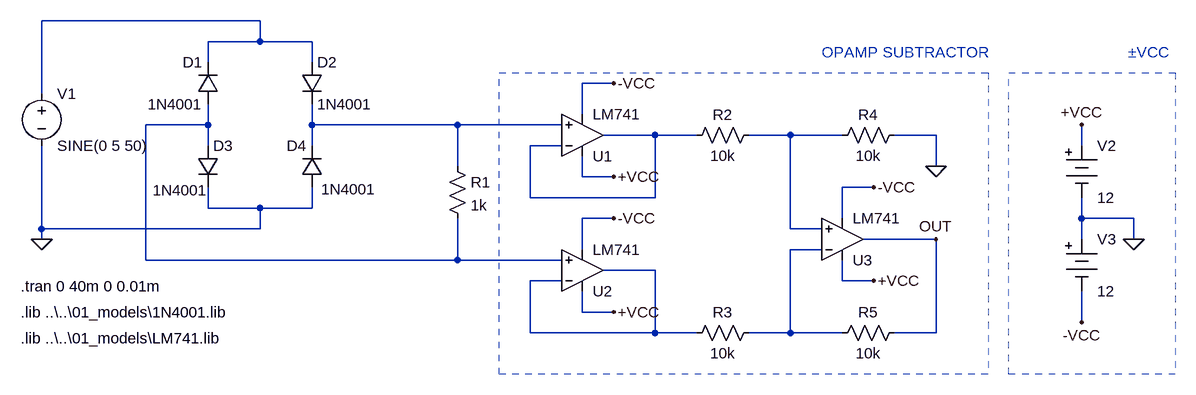
[diagram p0: schematic acdcconv_01_04_01_00_bridge_vr.asc]
acdcconv_01_04_01_00_bridge_vr.asc, the LTspice schematic file:
Version 4
SHEET 1 1572 680
WIRE 160 32 -176 32
WIRE 160 64 160 32
WIRE 160 64 80 64
WIRE 240 64 160 64
WIRE 80 96 80 64
WIRE 240 96 240 64
WIRE 704 128 656 128
WIRE -176 144 -176 32
WIRE 656 176 656 128
WIRE 80 192 80 160
WIRE 80 192 -16 192
WIRE 240 192 240 160
WIRE 464 192 240 192
WIRE 624 192 464 192
WIRE 768 208 688 208
WIRE 832 208 768 208
WIRE 976 208 912 208
WIRE 1056 208 976 208
WIRE 1200 208 1136 208
WIRE 80 224 80 192
WIRE 240 224 240 192
WIRE 624 224 576 224
WIRE 1424 224 1424 192
WIRE 464 256 464 192
WIRE 1200 256 1200 208
WIRE 656 272 656 240
WIRE 704 272 656 272
WIRE 1104 288 1056 288
WIRE 576 304 576 224
WIRE 768 304 768 208
WIRE 768 304 576 304
WIRE 80 320 80 288
WIRE 160 320 80 320
WIRE 240 320 240 288
WIRE 240 320 160 320
WIRE 704 336 656 336
WIRE 1056 336 1056 288
WIRE 1424 336 1424 304
WIRE 1504 336 1424 336
WIRE -176 352 -176 224
WIRE 160 352 160 320
WIRE 160 352 -176 352
WIRE 976 352 976 208
WIRE 1024 352 976 352
WIRE -176 368 -176 352
WIRE 1200 368 1088 368
WIRE 1424 368 1424 336
WIRE 1504 368 1504 336
WIRE 656 384 656 336
WIRE 1024 384 976 384
WIRE -16 400 -16 192
WIRE 464 400 464 336
WIRE 464 400 -16 400
WIRE 624 400 464 400
WIRE 768 416 688 416
WIRE 624 432 576 432
WIRE 1056 432 1056 400
WIRE 1104 432 1056 432
WIRE 656 480 656 448
WIRE 704 480 656 480
WIRE 1424 496 1424 448
WIRE 576 512 576 432
WIRE 768 512 768 416
WIRE 768 512 576 512
WIRE 832 512 768 512
WIRE 976 512 976 384
WIRE 976 512 912 512
WIRE 1056 512 976 512
WIRE 1200 512 1200 368
WIRE 1200 512 1136 512
FLAG -176 368 0
FLAG 1200 256 0
FLAG 1504 368 0
FLAG 1424 192 +VCC
FLAG 1424 496 -VCC
FLAG 704 272 +VCC
FLAG 704 128 -VCC
FLAG 704 480 +VCC
FLAG 704 336 -VCC
FLAG 1104 432 +VCC
FLAG 1104 288 -VCC
FLAG 1200 368 OUT
SYMBOL diode 96 160 R180
WINDOW 0 24 64 Left 2
WINDOW 3 24 0 Left 2
SYMATTR InstName D1
SYMATTR Value 1N4001
SYMBOL diode 224 96 R0
SYMATTR InstName D2
SYMATTR Value 1N4001
SYMBOL diode 64 224 R0
WINDOW 3 -69 69 Left 2
SYMATTR Value 1N4001
SYMATTR InstName D3
SYMBOL diode 256 288 R180
WINDOW 0 24 64 Left 2
WINDOW 3 2 -3 Right 2
SYMATTR InstName D4
SYMATTR Value 1N4001
SYMBOL res 448 240 R0
SYMATTR InstName R1
SYMATTR Value 1k
SYMBOL voltage -176 128 R0
WINDOW 123 0 0 Left 2
WINDOW 39 0 0 Left 2
SYMATTR InstName V1
SYMATTR Value SINE(0 5 50)
SYMBOL Opamps\\opamp2 656 272 M180
SYMATTR InstName U1
SYMATTR Value LM741
SYMBOL Opamps\\opamp2 656 480 M180
SYMATTR InstName U2
SYMATTR Value LM741
SYMBOL Opamps\\opamp2 1056 432 M180
SYMATTR InstName U3
SYMATTR Value LM741
SYMBOL res 928 192 R90
WINDOW 0 0 56 VBottom 2
WINDOW 3 32 56 VTop 2
SYMATTR InstName R2
SYMATTR Value 10k
SYMBOL res 928 496 R90
WINDOW 0 0 56 VBottom 2
WINDOW 3 32 56 VTop 2
SYMATTR InstName R3
SYMATTR Value 10k
SYMBOL res 1152 192 R90
WINDOW 0 0 56 VBottom 2
WINDOW 3 32 56 VTop 2
SYMATTR InstName R4
SYMATTR Value 10k
SYMBOL res 1152 496 R90
WINDOW 0 0 56 VBottom 2
WINDOW 3 32 56 VTop 2
SYMATTR InstName R5
SYMATTR Value 10k
SYMBOL Misc\\battery 1424 208 R0
WINDOW 123 0 0 Left 2
WINDOW 39 0 0 Left 2
SYMATTR InstName V2
SYMATTR Value 12
SYMBOL Misc\\battery 1424 352 R0
WINDOW 123 0 0 Left 2
WINDOW 39 0 0 Left 2
SYMATTR InstName V3
SYMATTR Value 12
TEXT -208 440 Left 2 !.tran 0 40m 0 0.01m
TEXT -208 480 Left 2 !.lib ..\\..\\01_models\\1N4001.lib
TEXT -208 520 Left 2 !.lib ..\\..\\01_models\\LM741.lib
TEXT 1496 80 Left 2 ;±VCC
TEXT 1024 80 Left 2 ;OPAMP SUBTRACTOR
RECTANGLE Normal 1568 576 1312 112 1
RECTANGLE Normal 1280 576 528 112 1

The netlist it stands for:
* acdcconv_01_04_01_00_bridge_vr.asc
D1 N002 N001 1N4001
D2 N001 N003 1N4001
D3 N002 0 1N4001
D4 0 N003 1N4001
R1 N003 N002 1k
V1 N001 0 SINE(0 5 50)
XU1 N003 N004 +VCC -VCC N004 LM741  ; pins In+ In- V+ V- OUT
XU2 N002 N007 +VCC -VCC N007 LM741  ; pins In+ In- V+ V- OUT
XU3 N005 N006 +VCC -VCC OUT LM741  ; pins In+ In- V+ V- OUT
R2 N005 N004 10k
R3 N006 N007 10k
R4 0 N005 10k
R5 OUT N006 10k
V2 +VCC 0 12
V3 0 -VCC 12
.model D D
.lib standard.dio
.tran 0 40m 0 0.01m
.lib ..\..\01_models\1N4001.lib
.lib ..\..\01_models\LM741.lib
* ±VCC
* OPAMP SUBTRACTOR
.backanno
.end